# EAGLE design mainboardv3.4 (EAGLE 6.4)
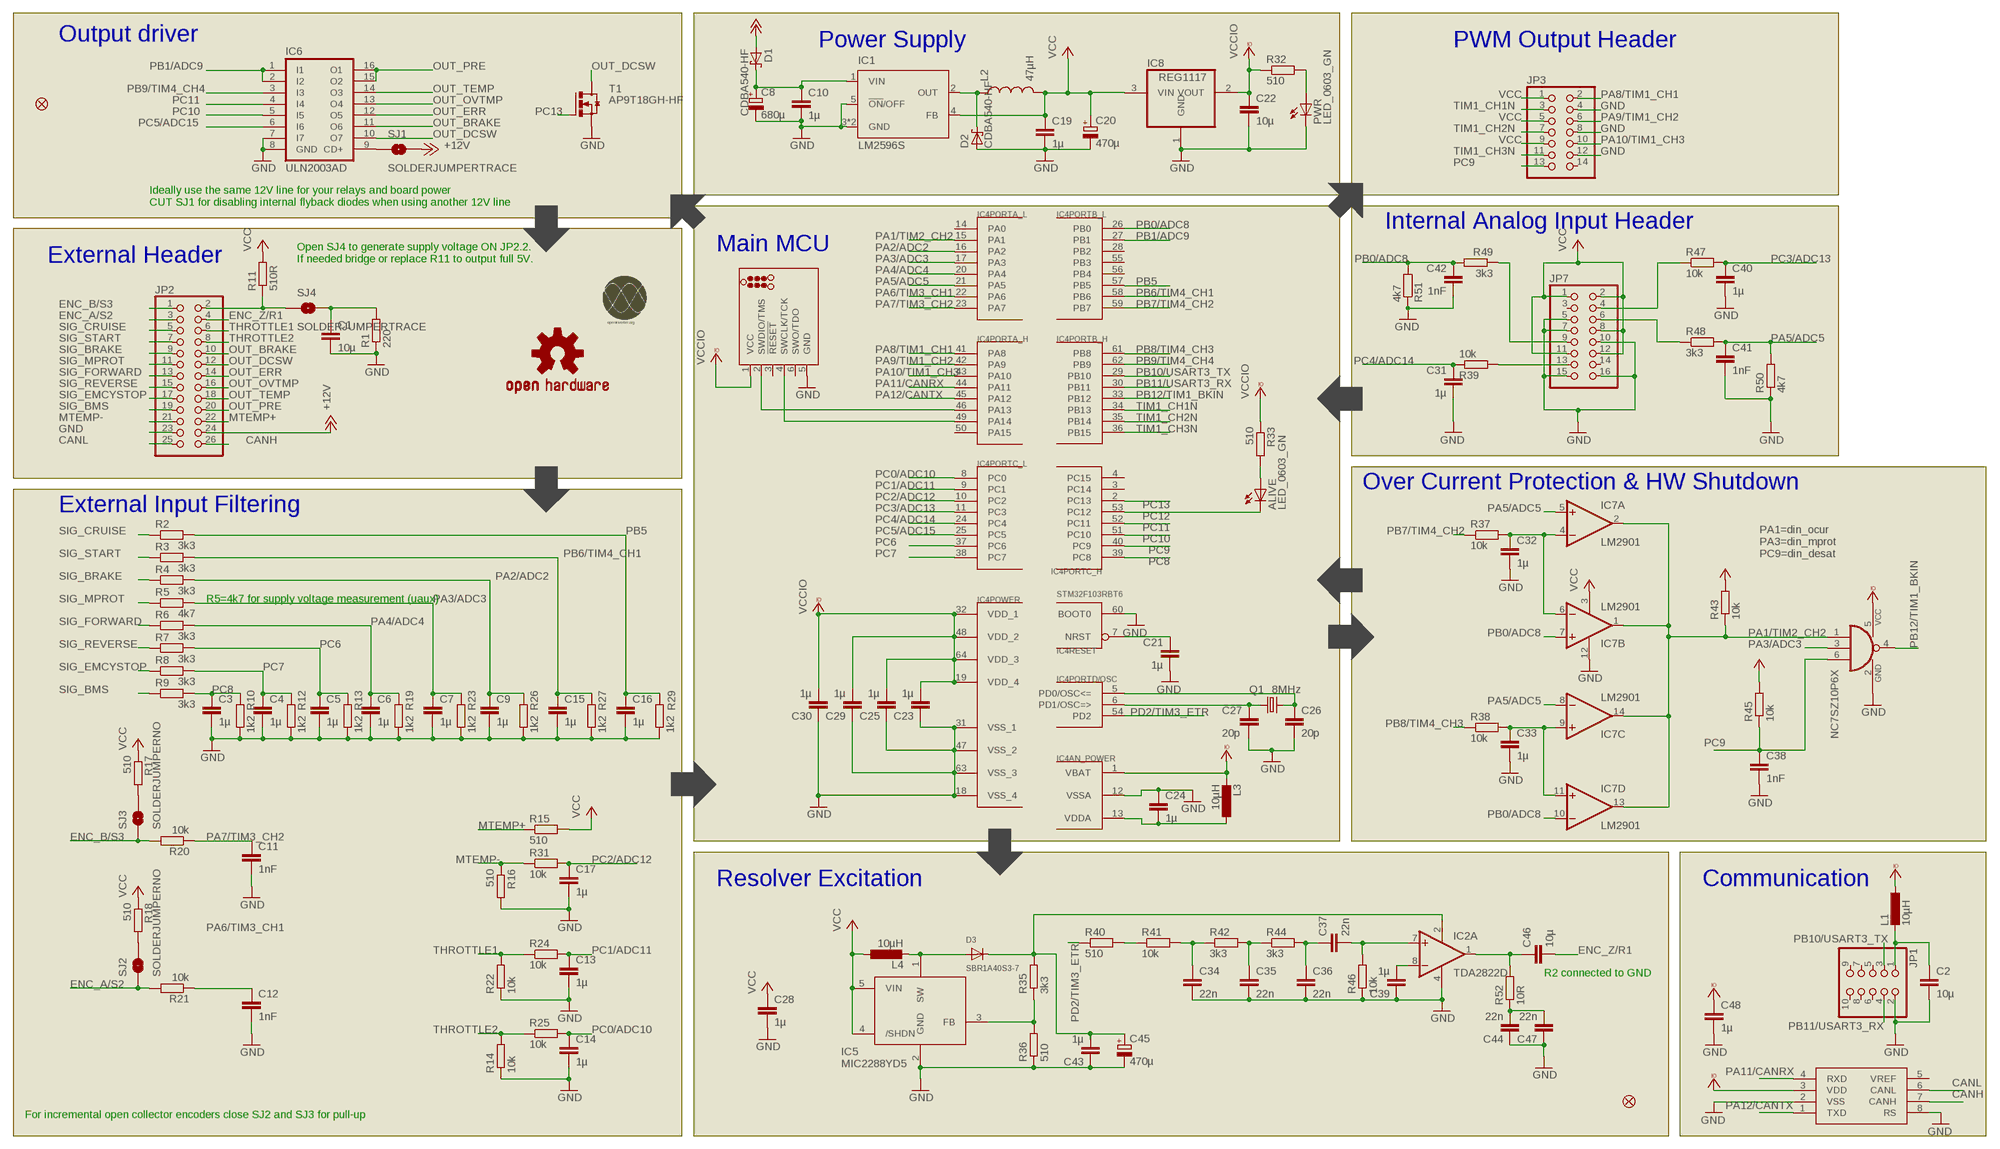
[diagram p0: schematic, sheet 1]

## Parts
ALIVE  LED_0603_GN  LEDSML0805  [SML0805]
C1  10µ  C-EUC0805  [C0805]
C2  10µ  C-EUC0805  [C0805]
C3  1µ  C-EUC0603  [C0603]
C4  1µ  C-EUC0603  [C0603]
C5  1µ  C-EUC0603  [C0603]
C6  1µ  C-EUC0603  [C0603]
C7  1µ  C-EUC0603  [C0603]
C8  680µ  CPOL-EUUD-10X10  [UD-10X10_NICHICON]
C9  1µ  C-EUC0603  [C0603]
C10  1µ  C-EUC0603  [C0603]
C11  1nF  C-EUC0603  [C0603]
C12  1nF  C-EUC0603  [C0603]
C13  1µ  C-EUC0603  [C0603]
C14  1µ  C-EUC0603  [C0603]
C15  1µ  C-EUC0603  [C0603]
C16  1µ  C-EUC0603  [C0603]
C17  1µ  C-EUC0603  [C0603]
C19  1µ  C-EUC0603  [C0603]
C20  470µ  CPOL-EUUD-6,3X7,7  [UD-6,3X7,7_NICHICON]
C21  1µ  C-EUC0603  [C0603]
C22  10µ  C-EUC0805  [C0805]
C23  1µ  C-EUC0603  [C0603]
C24  1µ  C-EUC0603  [C0603]
C25  1µ  C-EUC0603  [C0603]
C26  20p  C-EUC0603  [C0603]
C27  20p  C-EUC0603  [C0603]
C28  1µ  C-EUC0603  [C0603]
C29  1µ  C-EUC0603  [C0603]
C30  1µ  C-EUC0603  [C0603]
C31  1µ  C-EUC0603  [C0603]
C32  1µ  C-EUC0603  [C0603]
C33  1µ  C-EUC0603  [C0603]
C34  22n  C-EUC0603  [C0603]
C35  22n  C-EUC0603  [C0603]
C36  22n  C-EUC0603  [C0603]
C37  22n  C-EUC0603  [C0603]
C38  1nF  C-EUC0603  [C0603]
C39  1µ  C-EUC0603  [C0603]
C40  1µ  C-EUC0603  [C0603]
C41  1nF  C-EUC0603  [C0603]
C42  1nF  C-EUC0603  [C0603]
C43  1µ  C-EUC0603  [C0603]
C44  22n  C-EUC0603  [C0603]
C45  470µ  CPOL-EUUD-6,3X7,7  [UD-6,3X7,7_NICHICON]
C46  10µ  C-EUC0805  [C0805]
C47  22n  C-EUC0603  [C0603]
C48  1µ  C-EUC0603  [C0603]
D1  CDBA540-HF  SCHOTTKY-DIODESMD  [SMB]
D2  CDBA540-HF  SCHOTTKY-DIODESMD  [SMB]
D3  SBR1A40S3-7  DIODESOD-323F  [SOD-323F]
FID1  FIDUCIAL1X2.5  [FIDUCIAL-1X2.5]
FID2  FIDUCIAL1X2.5  [FIDUCIAL-1X2.5]
IC1  LM2596S  [TO263-5]
IC2  TDA2822D  [SO08]
IC3  SN65HVD230DR  MCP2551  [SO08]
IC4  STM32F103RBT6  STM32F10XRXT6  [TQFP64]
IC5  MIC2288YD5  [SOT23-5L]
IC6  ULN2003AD  [SO16]
IC7  LM2901  LM339D  [SO14]
IC8  REG1117  [SOT223]
IC9  NC7SZ10P6X  741G10X  [SC70-6]
J1  TC2030_SWD-MCP  [TC2030-MCP]
JP1  PINHD-2X5/90  [2X05/90]
JP2  PINHD-2X13  [2X13]
JP3  PINHD-2X7  [2X07]
JP7  PINHD-2X8  [2X08]
L1  10µH  L-EUL2012C  [L2012C]
L2  47µH  INDUCTORPWR  [CDRH125]
L3  10µH  L-EUL2012C  [L2012C]
L4  10µH  L-EUL2825P  [L2825P]
LOGO1  OSHW-LOGOM  [OSHW-LOGO-M]
PWR  LED_0603_GN  LEDSML0805  [SML0805]
Q1  8MHz  CRYSTALTXC-7A  [CRYSTAL-TXC-7A]
R1  220  R-EU_R0603  [R0603]
R2  3k3  R-EU_R0603  [R0603]
R3  3k3  R-EU_R0603  [R0603]
R4  3k3  R-EU_R0603  [R0603]
R5  4k7  R-EU_R0603  [R0603]
R6  3k3  R-EU_R0603  [R0603]
R7  3k3  R-EU_R0603  [R0603]
R8  3k3  R-EU_R0603  [R0603]
R9  3k3  R-EU_R0603  [R0603]
R10  1k2  R-EU_R0603  [R0603]
R11  510R  R-EU_R0603  [R0603]
R12  1k2  R-EU_R0603  [R0603]
R13  1k2  R-EU_R0603  [R0603]
R14  10k  R-EU_R0603  [R0603]
R15  510  R-EU_R0603  [R0603]
R16  510  R-EU_R0603  [R0603]
R17  510  R-EU_R0603  [R0603]
R18  510  R-EU_R0603  [R0603]
R19  1k2  R-EU_R0603  [R0603]
R20  10k  R-EU_R0603  [R0603]
R21  10k  R-EU_R0603  [R0603]
R22  10k  R-EU_R0603  [R0603]
R23  1k2  R-EU_R0603  [R0603]
R24  10k  R-EU_R0603  [R0603]
R25  10k  R-EU_R0603  [R0603]
R26  1k2  R-EU_R0603  [R0603]
R27  1k2  R-EU_R0603  [R0603]
R29  1k2  R-EU_R0603  [R0603]
R31  10k  R-EU_R0603  [R0603]
R32  510  R-EU_R0603  [R0603]
R33  510  R-EU_R0603  [R0603]
R35  3k3  R-EU_R0603  [R0603]
R36  510  R-EU_R0603  [R0603]
R37  10k  R-EU_R0603  [R0603]
R38  10k  R-EU_R0603  [R0603]
R39  10k  R-EU_R0603  [R0603]
R40  510  R-EU_R0603  [R0603]
R41  10k  R-EU_R0603  [R0603]
R42  3k3  R-EU_R0603  [R0603]
R43  10k  R-EU_R0603  [R0603]
R44  3k3  R-EU_R0603  [R0603]
R45  10k  R-EU_R0603  [R0603]
R46  10k  R-EU_R0603  [R0603]
R47  10k  R-EU_R0603  [R0603]
R48  3k3  R-EU_R0603  [R0603]
R49  3k3  R-EU_R0603  [R0603]
R50  4k7  R-EU_R0603  [R0603]
R51  4k7  R-EU_R0603  [R0603]
R52  10R  R-EU_R0603  [R0603]
SJ1  SOLDERJUMPERTRACE  [SJ_2S-TRACE]
SJ2  SOLDERJUMPERNO  [SJ_2S-NO]
SJ3  SOLDERJUMPERNO  [SJ_2S-NO]
SJ4  SOLDERJUMPERTRACE  [SJ_2S-TRACE]
T1  AP9T18GH-HF  [D-PAK_TO252AA]
U$1  OI-LOGO  [OI_LOGO]

## Nets
+12V: D1.A JP2.24 SJ1.2
CANH: IC3.7(CANH) JP2.26
CANL: IC3.6(CANL) JP2.25
ENC_A/S2: JP2.3 R21.2 SJ2.1
ENC_B/S3: JP2.1 R20.2 SJ3.1
ENC_Z/R1: C46.2 JP2.4
GND: C1.2 C2.2 C3.2 C4.2 C5.2 C6.2 C7.2 C8.- C9.2 C10.2 C11.2 C12.2 C13.2 C14.2 C15.2 C16.2 C17.2 C19.2 C20.- C21.2 C22.2 C23.1 C24.1 C25.1 C26.2 C27.2 C28.2 C29.1 C30.1 C31.2 C32.2 C33.2 C34.2 C35.2 C36.2 C38.2 C39.1 C40.2 C41.2 C42.2 C43.1 C44.1 C45.- C47.1 C48.2 D2.A IC1.3(GND) IC1.5(!ON!/OFF) IC1.6(GND) IC2.4(P:V-) IC3.2(VSS) IC3.8(RS) IC4.12(AN_POWER:VSSA) IC4.18(POWER:VSS_4) IC4.31(POWER:VSS_1) IC4.47(POWER:VSS_2) IC4.60(RESET:BOOT0) IC4.63(POWER:VSS_3) IC5.2(GND) IC6.7(I7) IC6.8(GND) IC7.12(P:GND) IC8.1(GND) IC9.2(PWR:GND) J1.5(GND) JP1.2 JP2.23 JP3.4 JP3.8 JP3.12 JP7.5 JP7.7 JP7.10 JP7.15 JP7.16 PWR.C R1.1 R10.1 R12.1 R13.1 R14.1 R16.2 R19.1 R22.1 R23.1 R26.1 R27.1 R29.1 R36.1 R46.1 R50.1 R51.1 T1.3(S)
I_L1: JP7.6 R48.1
I_L2: JP7.9 R49.1
MTEMP+: JP2.22 R15.1
MTEMP-: JP2.21 R16.1 R31.1
N$1: IC6.9(CD+) SJ1.1
N$2: C27.1 IC4.6(PORTD/OSC:PD1/OSC=>) Q1.P$1
N$3: R17.2 SJ3.2
N$4: C26.1 IC4.5(PORTD/OSC:PD0/OSC<=) Q1.P$2
N$5: IC4.46(PORTA_H:PA13) J1.2(SWDIO/TMS)
N$6: IC4.49(PORTA_H:PA14) J1.4(SWCLK/TCK)
N$7: C24.2 IC4.13(AN_POWER:VDDA) L3.1
N$8: R18.2 SJ2.2
N$9: C1.1 R1.2 SJ4.2
N$10: C33.1 IC7.9(C:+IN) IC7.11(D:+IN) R38.2
N$11: C44.2 C47.2 R52.1
N$12: R40.2 R41.1
N$14: D2.C IC1.2(OUT) L2.1
N$15: C32.1 IC7.4(A:-IN) IC7.6(B:-IN) R37.2
N$17: C35.1 R42.2 R44.1
N$18: C36.1 C37.1 R44.2
N$19: C37.2 IC2.7(A:+IN) R46.2
N$20: C46.1 IC2.1(A:OUT) R52.2
N$21: C43.2 C45.+ D3.C IC2.2(P:V+) R35.2
N$22: PWR.A R32.2
N$23: ALIVE.A R33.2
N$24: IC5.3(FB) R35.1 R36.2
N$25: C8.+ C10.1 D1.C IC1.1(VIN)
N$26: D3.A IC5.1(SW) L4.2
N$27: C39.2 IC2.8(A:-IN)
N$28: C2.1 JP1.1 L1.2
N$30: C34.1 R41.2 R42.1
NRST: C21.1 IC4.7(RESET:NRST)
OUT_BRAKE: IC6.11(O6) JP2.10
OUT_DCSW: IC6.10(O7) JP2.12 T1.4(D)
OUT_ERR: IC6.12(O5) JP2.14
OUT_OVTMP: IC6.13(O4) JP2.16
OUT_PRE: IC6.15(O2) IC6.16(O1) JP2.20
OUT_TEMP: IC6.14(O3) JP2.18
PA1/TIM2_CH2: IC4.15(PORTA_L:PA1) IC7.1(B:OUT) IC7.2(A:OUT) IC7.13(D:OUT) IC7.14(C:OUT) IC9.1(>NAME:I0) R43.1
PA2/ADC2: C9.1 IC4.16(PORTA_L:PA2) R4.2 R26.2
PA3/ADC3: C7.1 IC4.17(PORTA_L:PA3) IC9.3(>NAME:I1) R5.2 R23.2
PA4/ADC4: C6.1 IC4.20(PORTA_L:PA4) R6.2 R19.2
PA5/ADC5: C41.1 IC4.21(PORTA_L:PA5) IC7.5(A:+IN) IC7.8(C:-IN) R48.2 R50.2
PA6/TIM3_CH1: C12.1 IC4.22(PORTA_L:PA6) R21.1
PA7/TIM3_CH2: C11.1 IC4.23(PORTA_L:PA7) R20.1
PA8/TIM1_CH1: IC4.41(PORTA_H:PA8) JP3.2
PA9/TIM1_CH2: IC4.42(PORTA_H:PA9) JP3.6
PA10/TIM1_CH3: IC4.43(PORTA_H:PA10) JP3.10
PA11/CANRX: IC3.4(RXD) IC4.44(PORTA_H:PA11)
PA12/CANTX: IC3.1(TXD) IC4.45(PORTA_H:PA12)
PB0/ADC8: C42.1 IC4.26(PORTB_L:PB0) IC7.7(B:+IN) IC7.10(D:-IN) R49.2 R51.2
PB1/ADC9: IC4.27(PORTB_L:PB1) IC6.1(I1) IC6.2(I2)
PB5: C16.1 IC4.57(PORTB_L:PB5) R2.2 R29.2
PB6/TIM4_CH1: C15.1 IC4.58(PORTB_L:PB6) R3.2 R27.2
PB7/TIM4_CH2: IC4.59(PORTB_L:PB7) R37.1
PB8/TIM4_CH3: IC4.61(PORTB_H:PB8) R38.1
PB9/TIM4_CH4: IC4.62(PORTB_H:PB9) IC6.3(I3)
PB10/USART3_TX: IC4.29(PORTB_H:PB10) JP1.3
PB11/USART3_RX: IC4.30(PORTB_H:PB11) JP1.4
PB12/TIM1_BKIN: IC4.33(PORTB_H:PB12) IC9.4(>NAME:O)
PC0/ADC10: C14.1 IC4.8(PORTC_L:PC0) R25.2
PC1/ADC11: C13.1 IC4.9(PORTC_L:PC1) R24.2
PC2/ADC12: C17.1 IC4.10(PORTC_L:PC2) R31.2
PC3/ADC13: C40.1 IC4.11(PORTC_L:PC3) R47.2
PC4/ADC14: C31.1 IC4.24(PORTC_L:PC4) R39.1
PC5/ADC15: IC4.25(PORTC_L:PC5) IC6.6(I6)
PC6: C5.1 IC4.37(PORTC_L:PC6) R7.2 R13.2
PC7: C4.1 IC4.38(PORTC_L:PC7) R8.2 R12.2
PC8: C3.1 IC4.39(PORTC_H:PC8) R9.2 R10.2
PC9: C38.1 IC4.40(PORTC_H:PC9) IC9.6(>NAME:I2) JP3.13 R45.1
PC10: IC4.51(PORTC_H:PC10) IC6.5(I5)
PC11: IC4.52(PORTC_H:PC11) IC6.4(I4)
PC12: ALIVE.C IC4.53(PORTC_H:PC12)
PC13: IC4.2(PORTC_H:PC13) T1.1(G)
PD2/TIM3_ETR: IC4.54(PORTD/OSC:PD2) R40.1
S4/S1: JP2.2 R11.1 SJ4.1
SIG_BMS: JP2.19 R9.1
SIG_BRAKE: JP2.9 R4.1
SIG_CRUISE: JP2.5 R2.1
SIG_EMCYSTOP: JP2.17 R8.1
SIG_FORWARD: JP2.13 R6.1
SIG_MPROT: JP2.11 R5.1
SIG_REVERSE: JP2.15 R7.1
SIG_START: JP2.7 R3.1
THROTTLE1: JP2.6 R22.2 R24.1
THROTTLE2: JP2.8 R14.2 R25.1
TIM1_CH1N: IC4.34(PORTB_H:PB13) JP3.3
TIM1_CH2N: IC4.35(PORTB_H:PB14) JP3.7
TIM1_CH3N: IC4.36(PORTB_H:PB15) JP3.11
TMPHS: JP7.13 R39.2
UDC: JP7.4 R47.1
VCC: C19.1 C20.+ C28.1 IC1.4(FB) IC5.4(/SHDN) IC5.5(VIN) IC7.3(P:V+) IC8.3(VIN) JP3.1 JP3.5 JP3.9 JP7.1 JP7.2 JP7.8 JP7.11 JP7.12 L2.2 L4.1 R11.2 R15.2 R17.1 R18.1 R43.2 R45.2
VCCIO: C22.1 C23.2 C25.2 C29.2 C30.2 C48.1 IC3.3(VDD) IC4.1(AN_POWER:VBAT) IC4.19(POWER:VDD_4) IC4.32(POWER:VDD_1) IC4.48(POWER:VDD_2) IC4.64(POWER:VDD_3) IC8.2(VOUT) IC9.5(PWR:VCC) J1.1(VCC) L1.1 L3.2 R32.1 R33.1
Unconnected: IC2.3(B:OUT) IC2.5(B:-IN) IC2.6(B:+IN) IC3.5(VREF) IC4.3(PORTC_H:PC14) IC4.4(PORTC_H:PC15) IC4.14(PORTA_L:PA0) IC4.28(PORTB_L:PB2) IC4.50(PORTA_H:PA15) IC4.55(PORTB_L:PB3) IC4.56(PORTB_L:PB4) J1.3(!RESET) J1.6(SWO/TDO) JP1.5 JP1.6 JP1.7 JP1.8 JP1.9 JP1.10 JP3.14 JP7.3 JP7.14

## Notes on the sheet
- Output driver | Power Supply | PWM Output Header
- Ideally use the same 12V line for your relays and board power
  CUT SJ1 for disabling internal flyback diodes when using another 12V line
- Internal Analog Input Header
- Main MCU
- External Header
- Open SJ4 to generate supply voltage ON JP2.2. 
  If needed bridge or replace R11 to output full 5V.
- Over Current Protection & HW Shutdown
- External Input Filtering
- PA1=din_ocur
  PA3=din_mprot
  PC9=din_desat
- R5=4k7 for supply voltage measurement (uaux)
- Resolver Excitation | Communication
- R2 connected to GND
- IC5
  MIC2288YD5
- For incremental open collector encoders close SJ2 and SJ3 for pull-up

## Library data of the parts
ALIVE PWR = led:LED: LED OSRAM: - CHIPLED LG R971, LG N971, LY N971, LG Q971, LY Q971, LO R971, LY R971 LH N974, LH R974 LS Q976, LO Q976, LY Q976 LO Q996 - Hyper CHIPLED LW Q18S LB Q993, LB Q99A, LB R99A - SideLED LS A670, LO A670, LY A670, LG A670, LP A670 LB A673, LV A673, LT A673, LW A673 LH A674 LY A675 LS A676, LA A676, LO A676, LY A676, LW A676 LS A679, LY A679, LG A679 - Hyper Micro SIDELED® LS Y876, LA Y876, LO Y876, LY Y876 LT Y87S - SmartLED LW L88C, LW L88S LB L89C, LB L89S, LG L890 LS L89K, LO L89K, LY L89K LS L896, LA L896, LO L896, LY L896 - TOPLED LS T670, LO T670, LY T670, LG T670, LP T670 LSG T670, LSP T670, LSY T670, LOP T670, LYG T670 LG T671, LOG T671, LSG T671 LB T673, LV T673, LT T673, LW T673 LH T674 LS T676, LA T676, LO T676, LY T676, LB T676, LH T676, LSB T676, LW T676 LB T67C, LV T67C, LT T67C, LS T67K, LO T67K, LY T67K, LW E67C LS E67B, LA E67B, LO E67B, LY E67B, LB E67C, LV E67C, LT E67C LW T67C LS T679, LY T679, LG T679 LS T770, LO T770, LY T770, LG T770, LP T770 LB T773, LV T773, LT T773, LW T773 LH T774 LS E675, LA E675, LY E675, LS T675 LS T776, LA T776, LO T776, LY T776, LB T776 LHGB T686 LT T68C, LB T68C - Hyper Mini TOPLED® LB M676 - Mini TOPLED Santana® LG M470 LS M47K, LO M47K, LY M47K Source: http://www.osram.convergy.de LUXEON: - LUMILED® LXK2-PW12-R00, LXK2-PW12-S00, LXK2-PW14-U00, LXK2-PW14-V00 LXK2-PM12-R00, LXK2-PM12-S00, LXK2-PM14-U00 LXK2-PE12-Q00, LXK2-PE12-R00, LXK2-PE12-S00, LXK2-PE14-T00, LXK2-PE14-U00 LXK2-PB12-K00, LXK2-PB12-L00, LXK2-PB12-M00, LXK2-PB14-N00, LXK2-PB14-P00, LXK2-PB14-Q00 LXK2-PR12-L00, LXK2-PR12-M00, LXK2-PR14-Q00, LXK2-PR14-R00 LXK2-PD12-Q00, LXK2-PD12-R00, LXK2-PD12-S00 LXK2-PH12-R00, LXK2-PH12-S00 LXK2-PL12-P00, LXK2-PL12-Q00, LXK2-PL12-R00 Source: www.luxeon.com KINGBRIGHT: KA-3528ASYC Source: www.kingbright.com
C1-C7 C9-C17 C19 C21-C44 C46-C48 = rcl:C-EU: CAPACITOR, European symbol
C8 C20 C45 = rcl:CPOL-EU: POLARIZED CAPACITOR, European symbol
D1 D2 = diode:SCHOTTKY-DIODE: Schottky Diode
D3 = adafruit:DIODE: Diode SMADIODE - SMA Surface Mount Package 20V 1A Schottky Diode Digikey: 641-1014-6-ND DO-1N4148 - Through Hole Small Current Diode SOD-123 20V 1 A (.5mV Vf) Schottky Diode - Digikey: MBRX120TPMSCT-ND SOD-323 10V 570mA (.38mV Vf, 3ns) Schottky Diode - Digikey: ZLLS410CT-ND SOD-523 30V 30mA Schottky Diode (RB751S-40TE61) - Digikey: RB751S-40TE61CT-ND SOT23-R/W - SOT23 Package (R = Solder Paste/Reflow Ovens, W = Hand-Soldering) BAT54Film 40V 300mA - Digikey: 497-7162-1-ND
FID1 FID2 = SparkFun-Aesthetics:FIDUCIAL: Fiducial Alignment Points Various fiducial points for machine vision alignment.
IC1 = national-semiconductor:LM2596: SIMPLE SWITCHER® Power Converter 150 kHz 3A Step-Down Voltage Regulator Source: http://www.national.com/ds/LM/LM2596.pdf; MF: NATIONAL SEMICONDUCTOR; MPN: LM2596S-ADJ/NOPB; OC_FARNELL: 9494367; OC_NEWARK: 41K3842
IC2 = st-microelectronics:TDA2822: OP AMP
IC3 = SparkFun-DigitalIC:MCP2551: CAN transceiver
IC4 = stm32:STM32F10XRXT6: STM32F101/103 64pin LQFP
IC5 = adafruit:MIC2288
IC6 = uln-udn:ULN2003A: DRIVER ARRAY
IC7 = linear:LM339: Low Power Low Offset Voltage Quad Comparators with open collector; LM139/LM239/LM339/LM2901/LM3302
IC8 = burr-brown:REG1117: 800mA and 1A Low Dropout (LDO) Positive Regulator 1.8V, 2.5V, 2.85V, 3.3V, 5V, and Adj; MPN: REG1117; OC_FARNELL: 1097566; OC_NEWARK: 14P6981
IC9 = 74xx-eu:74*1G10: 3-input NAND gate
J1 = tag-connect:TC2030_SWD: ARM20-CTX 20-Pin to TC2030-IDC Adapter for Cortex 6-Pin (TC2030-IDC family) </catalog/6> Cortex SWD </catalog/9> Adapters </adaptors> <javascript:void(0);> The Tag-Connect ARM20-CTX adapter board allows our TC2030-IDC cables to be used for ARM SWD (Single Wire Debug) applications. Although intended for use with our patented TC2030-IDC (and TC2030-IDC-NL) Plug-of-Nails™ Cables, the adapter may be useful to people wishing to use 6-pin 0.1” ribbon headers on their PCB instead of the traditional 20-Pin header. Please note the TC2030-IDC <http://tag-connect.com/TC2030-IDC> or TC2030-IDC-NL <http://tag-connect.com/TC2030-IDC-NL> cable is purchased separately, the cables and Segger JLINK seen in the pictures are not included! Download the Datasheet here. <http://www.tag-connect.com/Materials/ARM20-CTX.pdf>
JP1 = pinhead:PINHD-2X5: PIN HEADER
JP2 = pinhead:PINHD-2X13: PIN HEADER
JP3 = pinhead:PINHD-2X7: PIN HEADER
JP7 = pinhead:PINHD-2X8: PIN HEADER
L1 L3 L4 = rcl:L-EU: INDUCTOR, European symbol
L2 = SparkFun-Passives:INDUCTOR: Inductors Basic Inductor/Choke - 0603 and 1206. Footprints are not proven and vary greatly between part numbers. SRN6045- 33uH, 20% 1.4A
LOGO1 = SparkFun-Aesthetics:OSHW-LOGO: Open Source Hardware Logo This logo indicates the piece of hardware it is found on incorporates a OSHW license and/or adheres to the definition of open source hardware found here: http://freedomdefined.org/OSHW
Q1 = SparkFun-FreqCtrl:CRYSTAL: Various standard crystals. Proven footprints. Spark Fun Electronics SKU : COM-00534
R1-R27 R29 R31-R33 R35-R52 = rcl:R-EU_: RESISTOR, European symbol
SJ1-SJ4 = SparkFun-Passives:SOLDERJUMPER: Solder Jumper Standard SMD solder jumper. Used to automate production. Two varients : Normally Open and Normally Closed are the same, but have different paste layers. NC will have a large amount of paste and should jumper during reflow.
T1 = transistor-power:AP9T18GH-HF
U$1 = SparkFun-Aesthetics:OI-LOGO

## Board
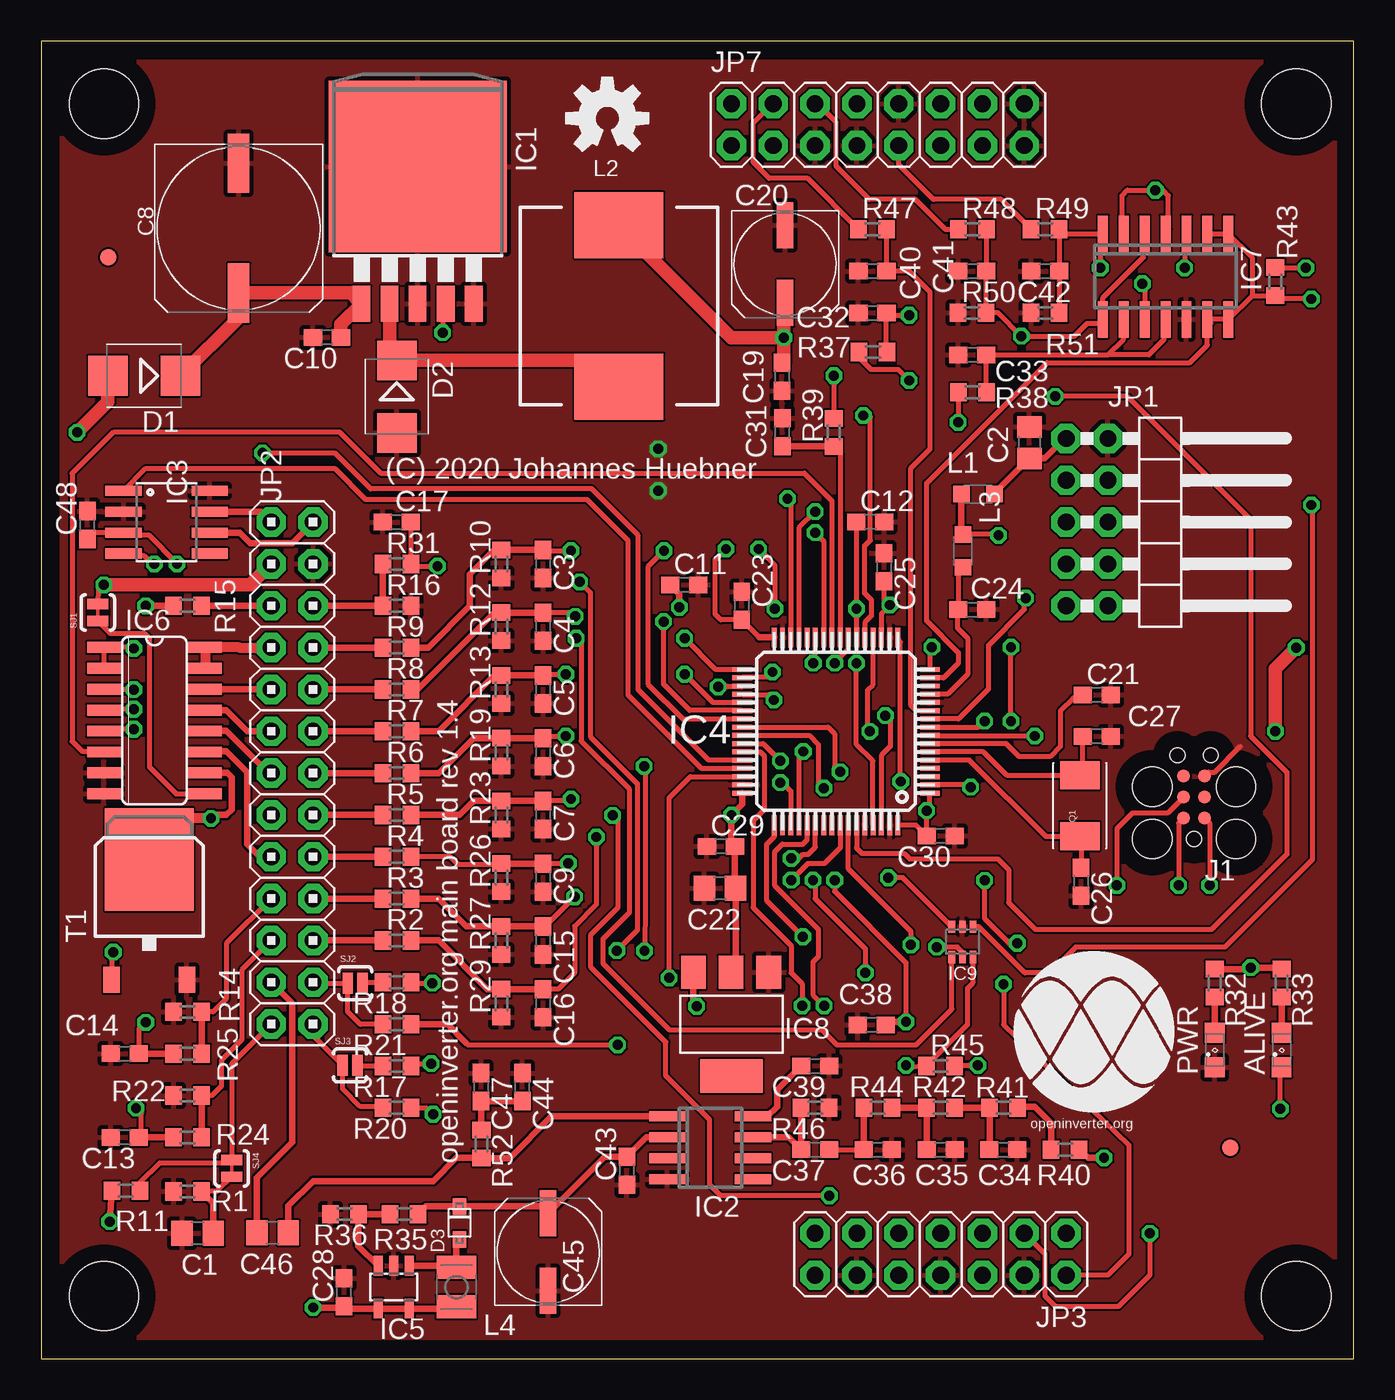
[diagram p1: board, top side]
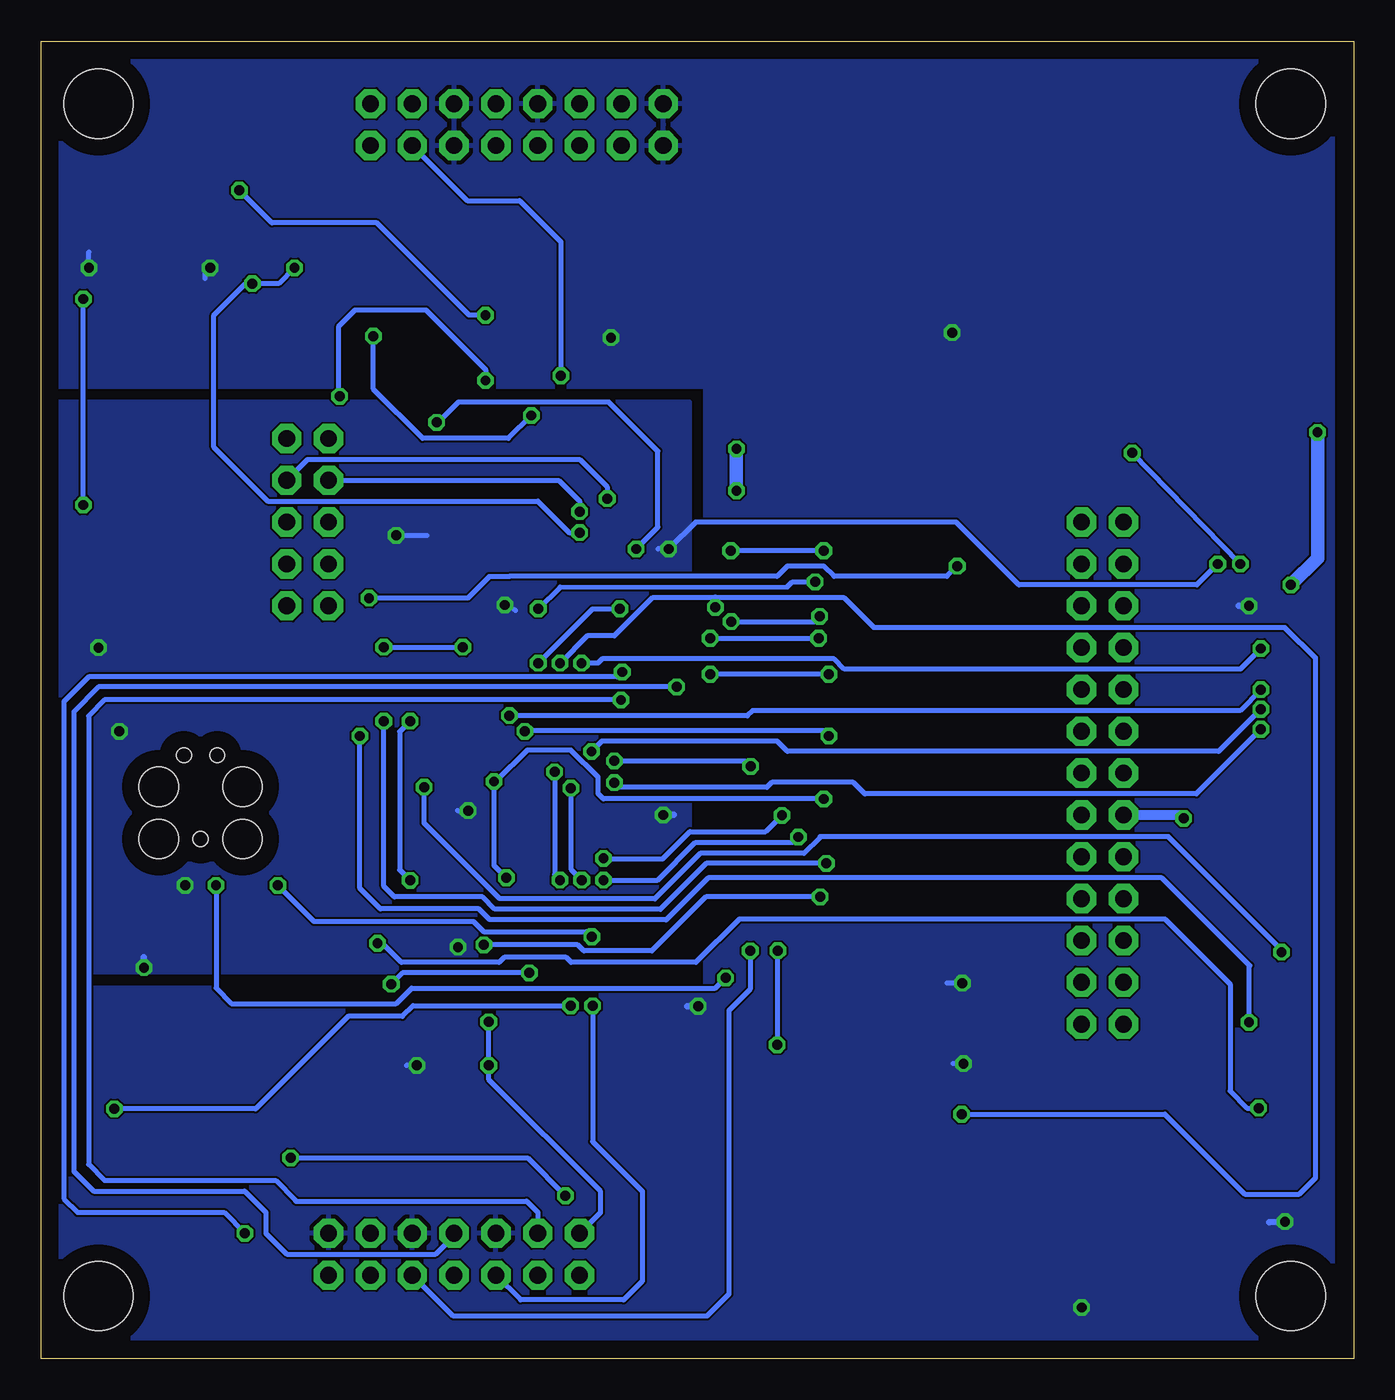
[diagram p2: board, bottom side, seen from below]

Size 79.68 x 80 mm. Coordinates in mm from the lower left corner, seen from the top.
Outline: 0,0 79.68,0 79.68,80 0,80 0,0
Copper layers (1*16): Top 0.035mm / dielectric 1.5mm / Bottom 0.035mm
Design rules "default *": minimum track width 10mil, minimum drill 0.5mm, track to track 5mil, track to pad 5mil, pad to pad 5mil, via to via 5mil, smd to smd 5mil, copper to edge 40mil, drill to drill 8mil, minimum pad ring 15mil, minimum via ring 8mil, stop-mask expansion 4mil, vias tented up to drill 0mil, thermal gap 10mil
Holes 4.2 mm at 3.81,76.2 76.2,76.2 3.81,3.81 76.2,3.81

### Footprints (pad centres in the part's own frame; a part is rotated, then mirrored left to right if it is on the bottom)
SML0805 = smd 1.2 x 1.2: A 1.05,0; C -1.05,0
C0805 = smd 1.3 x 1.5: 1 -0.95,0; 2 0.95,0
C0603 = smd 1.1 x 1: 1 -0.85,0; 2 0.85,0
UD-10X10_NICHICON = smd 3.6 x 1.3: + 3.925,0; - -3.95,0
UD-6,3X7,7_NICHICON = smd 2.8 x 1: + 2.35,0; - -2.35,0
SMB = smd 2.4 x 2.4: A 2.2,0; C -2.2,0
SOD-323F = smd 1 x 0.8: A -1,0; C 1,0
FIDUCIAL-1X2.5 = smd 1 x 1: 1 0,0
TO263-5 = smd 1.067 x 2.159: 1 -3.404,-5.791; 2 -1.702,-5.791; 3 0,-5.791; 4 1.702,-5.791; 5 3.404,-5.791 | smd 10.8 x 10.41: 6 0,2.54
SO08 = smd 0.6 x 2.2: 1 -1.905,-2.6; 2 -0.635,-2.6; 3 0.635,-2.6; 4 1.905,-2.6; 5 1.905,2.6; 6 0.635,2.6; 7 -0.635,2.6; 8 -1.905,2.6
SO08' = smd 0.61 x 2.21: 1 -1.905,-2.616; 2 -0.635,-2.616; 3 0.635,-2.616; 4 1.905,-2.616; 5 1.905,2.616; 6 0.635,2.616; 7 -0.635,2.616; 8 -1.905,2.616
TQFP64 = smd 1.2 x 0.3: 1 -5.7,3.75; 2 -5.7,3.25; 3 -5.7,2.75; 4 -5.7,2.25; 5 -5.7,1.75; 6 -5.7,1.25; 7 -5.7,0.75; 8 -5.7,0.25; 9 -5.7,-0.25; 10 -5.7,-0.75; 11 -5.7,-1.25; 12 -5.7,-1.75; 13 -5.7,-2.25; 14 -5.7,-2.75; 15 -5.7,-3.25; 16 -5.7,-3.75; 33 5.7,-3.75; 34 5.7,-3.25; 35 5.7,-2.75; 36 5.7,-2.25; 37 5.7,-1.75; 38 5.7,-1.25; 39 5.7,-0.75; 40 5.7,-0.25; 41 5.7,0.25; 42 5.7,0.75; 43 5.7,1.25; 44 5.7,1.75; 45 5.7,2.25; 46 5.7,2.75; 47 5.7,3.25; 48 5.7,3.75 | smd 0.3 x 1.2: 17 -3.75,-5.7; 18 -3.25,-5.7; 19 -2.75,-5.7; 20 -2.25,-5.7; 21 -1.75,-5.7; 22 -1.25,-5.7; 23 -0.75,-5.7; 24 -0.25,-5.7; 25 0.25,-5.7; 26 0.75,-5.7; 27 1.25,-5.7; 28 1.75,-5.7; 29 2.25,-5.7; 30 2.75,-5.7; 31 3.25,-5.7; 32 3.75,-5.7; 49 3.75,5.7; 50 3.25,5.7; 51 2.75,5.7; 52 2.25,5.7; 53 1.75,5.7; 54 1.25,5.7; 55 0.75,5.7; 56 0.25,5.7; 57 -0.25,5.7; 58 -0.75,5.7; 59 -1.25,5.7; 60 -1.75,5.7; 61 -2.25,5.7; 62 -2.75,5.7; 63 -3.25,5.7; 64 -3.75,5.7
SOT23-5L = smd 0.55 x 1.2: 1 -0.95,-1.3; 2 0,-1.3; 3 0.95,-1.3; 4 0.95,1.3; 5 -0.95,1.3
SO16 = smd 0.66 x 2.032: 1 -4.445,-3.073; 2 -3.175,-3.073; 3 -1.905,-3.073; 4 -0.635,-3.073; 5 0.635,-3.073; 6 1.905,-3.073; 7 3.175,-3.073; 8 4.445,-3.073; 9 4.445,3.073; 10 3.175,3.073; 11 1.905,3.073; 12 0.635,3.073; 13 -0.635,3.073; 14 -1.905,3.073; 15 -3.175,3.073; 16 -4.445,3.073
SO14 = smd 0.6 x 2.2: 1 -3.81,-2.6; 2 -2.54,-2.6; 3 -1.27,-2.6; 4 0,-2.6; 5 1.27,-2.6; 6 2.54,-2.6; 7 3.81,-2.6; 8 3.81,2.6; 9 2.54,2.6; 10 1.27,2.6; 11 0,2.6; 12 -1.27,2.6; 13 -2.54,2.6; 14 -3.81,2.6
SOT223 = smd 1.499 x 2.007: 1 -2.261,-3.15; 2 0.025,-3.15; 3 2.311,-3.15 | smd 3.81 x 2.007: 4 0,3.15
SC70-6 = smd 0.4 x 0.75: 1 -0.65,-0.925; 2 0,-0.925; 3 0.65,-0.925; 4 0.65,0.925; 5 0,0.925; 6 -0.65,0.925
TC2030-MCP = smd 0.787 x 0.787: 1 1.27,-0.635; 2 1.27,0.635; 3 2.54,-0.635; 4 2.54,0.635; 5 3.81,-0.635; 6 3.81,0.635 | hole 0.889: 0,0; 5.08,-1.016; 5.08,1.016 | hole 2.375: 0,2.54; 0,-2.54; 3.175,-2.54; 3.175,2.54
2X05/90 = drill 1.016 octagon: 1 -5.08,-6.35; 2 -5.08,-3.81; 3 -2.54,-6.35; 4 -2.54,-3.81; 5 0,-6.35; 6 0,-3.81; 7 2.54,-6.35; 8 2.54,-3.81; 9 5.08,-6.35; 10 5.08,-3.81
2X13 = drill 1.016 octagon: 1 -15.24,-1.27; 2 -15.24,1.27; 3 -12.7,-1.27; 4 -12.7,1.27; 5 -10.16,-1.27; 6 -10.16,1.27; 7 -7.62,-1.27; 8 -7.62,1.27; 9 -5.08,-1.27; 10 -5.08,1.27; 11 -2.54,-1.27; 12 -2.54,1.27; 13 0,-1.27; 14 0,1.27; 15 2.54,-1.27; 16 2.54,1.27; 17 5.08,-1.27; 18 5.08,1.27; 19 7.62,-1.27; 20 7.62,1.27; 21 10.16,-1.27; 22 10.16,1.27; 23 12.7,-1.27; 24 12.7,1.27; 25 15.24,-1.27; 26 15.24,1.27
2X07 = drill 1.016 octagon: 1 -7.62,-1.27; 2 -7.62,1.27; 3 -5.08,-1.27; 4 -5.08,1.27; 5 -2.54,-1.27; 6 -2.54,1.27; 7 0,-1.27; 8 0,1.27; 9 2.54,-1.27; 10 2.54,1.27; 11 5.08,-1.27; 12 5.08,1.27; 13 7.62,-1.27; 14 7.62,1.27
2X08 = drill 1.016 octagon: 1 -8.89,-1.27; 2 -8.89,1.27; 3 -6.35,-1.27; 4 -6.35,1.27; 5 -3.81,-1.27; 6 -3.81,1.27; 7 -1.27,-1.27; 8 -1.27,1.27; 9 1.27,-1.27; 10 1.27,1.27; 11 3.81,-1.27; 12 3.81,1.27; 13 6.35,-1.27; 14 6.35,1.27; 15 8.89,-1.27; 16 8.89,1.27
L2012C = smd 1 x 1: 1 -1,0; 2 1,0
CDRH125 = smd 5.4 x 4: 1 0,4.9; 2 0,-4.9
L2825P = smd 1.4 x 2.4: 1 -1.2,0; 2 1.2,0
CRYSTAL-TXC-7A = smd 1.7 x 2.4: P$1 1.85,0; P$2 -1.85,0
R0603 = smd 1 x 1.1: 1 -0.85,0; 2 0.85,0
SJ_2S-TRACE = smd 0.635 x 1.27: 1 -0.508,0; 2 0.508,0
SJ_2S-NO = smd 0.635 x 1.27: 1 -0.45,0; 2 0.45,0
D-PAK_TO252AA = smd 1 x 1.6: 1 -2.28,-4.8; 3 2.28,-4.8 | smd 5.4 x 6.2: 4 0,2.5

### Placement (x,y rotation side)
ALIVE  75.31,18.75 90 top
C1  9.5,7.62 180 top
C2  60,55.62 90 top
C3  30.48,48.26 270 top
C4  30.48,44.45 270 top
C5  30.48,40.64 270 top
C6  30.48,36.83 270 top
C7  30.48,33.02 270 top
C8  11.98,68.64 270 top
C9  30.48,29.21 270 top
C10  17.35,62.02 180 top
C11  39.03,46.99 0 top
C12  50.34,50.81 0 top
C13  5.08,13.45 180 top
C14  5.08,18.52 180 top
C15  30.48,25.4 270 top
C16  30.48,21.59 270 top
C17  21.59,50.8 180 top
C19  44.98,59.62 270 top
C20  45.16,66.47 270 top
C21  64.09,40.31 0 top
C22  41.22,28.57 180 top
C23  42.53,45.72 270 top
C24  56.52,45.5 180 top
C25  51.19,48.07 270 top
C26  63.13,28.96 270 top
C27  64.09,37.78 0 top
C28  18.39,4.05 90 top
C29  41.27,31.11 0 top
C30  54.61,31.75 180 top
C31  45,56.25 90 top
C32  50.47,63.5 180 top
C33  56.54,60.96 180 top
C34  58.42,12.7 0 top
C35  54.61,12.7 0 top
C36  50.8,12.7 0 top
C37  46.99,12.7 180 top
C38  50.43,20.28 180 top
C39  46.99,17.78 180 top
C40  50.47,66.04 180 top
C41  56.54,66.04 180 top
C42  60.96,66.04 180 top
C43  35.56,11.43 90 top
C44  29.21,16.5 270 top
C45  30.79,6.49 90 top
C46  14.05,7.66 180 top
C47  26.71,16.5 270 top
C48  2.81,50.62 90 top
D1  6.25,59.69 180 top
D2  21.59,58.42 270 top
D3  25.4,8.26 90 top
FID1  72.19,12.81 0 top
FID2  4.06,66.88 0 top
IC1  22.86,69.85 0 top
IC2  40.62,12.81 270 top
IC3  SN65HVD230DR  [SO08']  7.62,50.8 270 top
IC4  48.26,38.1 180 top
IC5  21.4,4.35 180 top
IC6  6.88,38.75 270 top
IC7  68.27,65.71 180 top
IC8  41.91,20.32 180 top
IC9  55.94,25.31 180 top
J1  70,31.56 90 top
JP1  68.58,50.8 270 top
JP2  15.24,35.56 90 top
JP3  54.61,6.35 180 top
JP7  50.8,74.93 0 top
L1  56.88,52.5 0 top
L2  35.08,63.92 180 top
L3  55.96,49.06 90 top
L4  25.21,4.35 90 top
LOGO1  34.38,75.31 0 top
PWR  71.25,18.75 90 top
Q1  63.06,33.58 90 top
R1  8.89,10.16 0 top
R2  21.59,25.4 0 top
R3  21.59,27.94 0 top
R4  21.59,30.48 0 top
R5  21.59,33.02 0 top
R6  21.59,35.56 0 top
R7  21.59,38.1 0 top
R8  21.59,40.64 0 top
R9  21.59,43.18 0 top
R10  27.94,48.26 90 top
R11  5.14,10.2 180 top
R12  27.94,44.45 90 top
R13  27.94,40.64 90 top
R14  8.89,21.07 0 top
R15  8.89,45.72 180 top
R16  21.59,45.72 0 top
R17  21.59,17.78 180 top
R18  21.59,22.86 180 top
R19  27.94,36.83 90 top
R20  21.59,15.24 180 top
R21  21.59,20.32 180 top
R22  8.89,15.98 0 top
R23  27.94,33.02 90 top
R24  8.89,13.45 180 top
R25  8.89,18.52 180 top
R26  27.94,29.21 90 top
R27  27.94,25.4 90 top
R29  27.94,21.59 90 top
R31  21.59,48.26 0 top
R32  71.25,22.81 270 top
R33  75.31,22.81 270 top
R35  22.04,8.79 0 top
R36  18.41,8.79 0 top
R37  50.5,61.13 0 top
R38  56.55,58.69 0 top
R39  48.12,56.25 90 top
R40  62.17,12.7 180 top
R41  58.44,15.24 180 top
R42  54.61,15.24 180 top
R43  74.93,65.39 90 top
R44  50.8,15.24 180 top
R45  54.61,17.78 0 top
R46  46.99,15.24 180 top
R47  50.47,68.58 0 top
R48  56.54,68.58 0 top
R49  60.96,68.58 0 top
R50  56.52,63.5 0 top
R51  60.96,63.5 0 top
R52  26.74,13.04 270 top
SJ1  3.44,45.31 90 top
SJ2  19.06,22.81 0 top
SJ3  18.75,17.81 0 top
SJ4  11.56,11.56 270 top
T1  6.56,27.81 0 top
U$1  59.06,15 0 top

### Tracks (layer width: path | path; a pad name or v marks a point on that pad's centre or on a via)
+12V  (via drill 0.6)
  Top 0.305: v3.81,46.99 3.49,46.98 3.44,46.09 SJ1.2
  Top 0.813: v3.81,46.99 12.7,46.99 JP2.24 | v2.19,56.25 4.05,58.11 D1.A
  Bottom 0.813: v3.81,46.99 2.19,48.61 v2.19,56.25
CANH
  Top 0.406: IC3.7 13.34,51.44 JP2.26
CANL
  Top 0.406: JP2.25 15.24,49.53 12.7,49.53 12.06,50.16 IC3.6
ENC_A/S2
  Top 0.305: JP2.3 16.56,22.81 SJ2.1 18.61,21.07 19.38,20.31 R21.2
ENC_B/S3
  Top 0.305: JP2.1 16.51,19.6 SJ3.1 18.3,16.39 19.38,15.31 20.67,15.31 R20.2
ENC_Z/R1
  Top 0.406: JP2.4 15.24,21.59 15.24,13.14 13.1,11 C46.2
GND  (via drill 0.6)
  Top 0.305: J1.5 70.89,35.62 71.25,35.62 72.81,37.19
  Bottom 0.813: v37.47,55.24 v37.47,52.7
  pour Top: 1.27,78.74 78.74,78.74 78.74,1.27 1.27,1.27
I_L1
  Top 0.305: R48.1 54.9,68.58 53.08,70.4 50.27,70.4 48.26,72.41 48.26,75.08 47.13,76.2 JP7.6
I_L2
  Top 0.305: R49.1 58.29,70.4 54.17,70.4 52.07,72.5 JP7.9
MTEMP+
  Top 0.406: R15.1 JP2.22
MTEMP-
  Top 0.406: R31.1 R16.1 JP2.21
N$1
  Top 0.305: SJ1.1 4.18,44.06 6.25,44.06 6.56,43.75 6.56,35.94 8.2,34.3 IC6.9
N$2
  Top 0.305: IC4.6 57.21,36.85 58.63,35.43 Q1.P$1 63.24,35.61 C27.1
N$3
  Top 0.305: SJ3.2 19.23,17.78 R17.2
N$4
  Top 0.305: IC4.5 56.36,36.35 61.01,31.7 61.04,31.73 Q1.P$2 63.13,31.66 C26.1
N$5  (via drill 0.6)
  Top 0.305: J1.2 69.06,32.53 v69.06,28.75 | v38.12,23.12 38.12,34.06 39.41,35.35 IC4.46
  Bottom 0.305: v69.06,28.75 69.06,22.5 68.12,21.56 58.12,21.56 57.19,22.5 38.75,22.5 v38.12,23.12
N$6  (via drill 0.6)
  Top 0.305: J1.4 68.39,33.12 66.25,33.12 65.31,32.19 v65.31,28.75 | v46.25,25.62 44.06,27.81 44.06,31.25 44.51,31.7 IC4.49
  Bottom 0.305: v65.31,28.75 63.12,26.56 53.44,26.56 52.81,25.94 46.56,25.94 v46.25,25.62
N$7
  Top 0.305: L3.1 55.67,47.77 C24.2 55.62,45.45 55.62,44.38 56.25,43.75 56.25,41.56 55.04,40.35 IC4.13
N$8
  Top 0.305: SJ2.2 19.56,22.86 R18.2
N$9
  Top 0.305: SJ4.2 10.67,10.16 R1.2
  Top 0.406: R1.2 10.45,9.45 C1.1
N$10
  Top 0.305: IC7.11 68.14,62.98 68.17,62.95 68.17,61.88 67.25,60.96 64.77,60.96 | 64.77,60.96 C33.1 R38.2 | 64.77,60.96 65.73,61.92 IC7.9
N$11
  Top 0.406: C44.2 C47.2 26.71,13.92 R52.1
N$12
  Top 0.406: R40.2 61.32,14.3 60.31,15.31 59.36,15.31 R41.1
N$14
  Top 0.813: 21.09,63.99 IC1.2 21.16,61.05 D2.C 33.48,60.62 L2.1
N$15  (via drill 0.6)
  Top 0.305: R37.2 51.32,61.16 C32.1 51.46,63.36 v52.7,63.36 | IC7.4 68.21,68.36 68.44,68.59 68.44,70.62 68.11,70.95 v67.65,70.95 65.95,70.95 65.62,70.62 65.62,68.41 IC7.6
  Bottom 0.305: v52.7,63.36 53.69,63.36 59.3,68.97 65.67,68.97 v67.65,70.95
N$17
  Top 0.406: R44.1 R42.2 C35.1
N$18
  Top 0.305: C37.1 C36.1
  Top 0.406: R44.2 C36.1
N$19
  Top 0.406: IC2.7 45.39,13.45 C37.2 R46.2
N$20
  Top 0.406: C46.1 15,9.29 16.51,10.79 23.81,10.79 25.21,12.2 R52.2 26.75,12.19 28.44,12.19 30.97,14.72 IC2.1
N$21
  Top 0.406: R35.2 23.36,9.26 D3.C 30.68,9.26 C45.+ 34.22,12.28 C43.2 36.73,13.45 IC2.2
N$22
  Top 0.406: R32.2 PWR.A
N$23
  Top 0.406: R33.2 ALIVE.A
N$24
  Top 0.406: R35.1 R36.2 19.27,6.84 IC5.3
N$25
  Top 0.813: IC1.1 19.14,64.38 | IC1.1 18.8,64.71 C8.+ 11.98,63.22 D1.C | C10.1 18.2,62.8 IC1.1
N$26
  Top 0.406: IC5.1 24.91,5.65 L4.2 25.21,7.07 D3.A
N$27
  Top 0.406: C39.2 44.69,16.33 44.69,15.31 44.09,14.72 IC2.8
N$28
  Top 0.305: L1.2 57.88,52.55 | JP1.1 62.13,55.88 | 60.01,54.69 C2.1
  Top 0.406: 57.88,52.55 C2.1 | 62.13,55.88 60.94,54.69 60.01,54.69
N$30
  Top 0.406: R42.1 R41.2 57.59,12.72 C34.1
NRST
  Top 0.305: IC4.7 58.59,37.35 59.38,36.56 61.25,36.56 61.88,37.19 61.88,39.34 62.66,40.12 C21.1
OUT_BRAKE
  Top 0.406: JP2.10 13.27,30.48 12.5,31.25 12.5,35.62 11.25,36.88 9.98,36.88 IC6.11
OUT_DCSW  (via drill 0.6)
  Top 0.406: IC6.10 11.3,35.58 11.56,35.31 11.56,33.33 11.25,33.02 10.52,33.02 v10.31,32.81
  Top 0.61: v10.31,32.81 9.06,32.81 T1.4
  Bottom 0.61: JP2.12 10.52,33.02 v10.31,32.81
OUT_ERR
  Top 0.406: JP2.14 13.81,35.56 11.25,38.12 IC6.12
OUT_OVTMP
  Top 0.406: JP2.16 12.53,38.1 11.25,39.38 IC6.13
  Top 0.61: JP2.16 13.96,38.12
OUT_PRE
  Top 0.305: 12.06,43.17 12.04,43.2
  Top 0.61: 12.06,43.17 12.7,43.18 JP2.20 | 12.04,43.2 IC6.16 IC6.15
OUT_TEMP
  Top 0.406: JP2.18 9.96,40.64 IC6.14
PA1/TIM2_CH2  (via drill 0.6)
  Top 0.305: IC7.13 IC7.14 73.52,64.55 | 73.52,64.55 R43.1 75.12,64.35 v77.12,64.35 | IC7.2 IC7.1 73.52,66.87 73.52,64.55 | IC7.13 71.02,62.9 | IC4.15 54.79,41.35 55.68,42.24 55.68,42.88 53.76,44.8 53.76,53.16 61.08,60.48 69.74,60.48 70.81,61.55 IC7.13 | IC9.1 56.92,26.24 59.73,23.43 61.24,23.43 62.81,25 71.88,25 77.19,30.31 77.19,51.77 v77.12,51.84
  Bottom 0.305: v77.12,51.84 v77.12,64.35
PA2/ADC2  (via drill 0.6)
  Top 0.305: C9.1 30.5,30.08 v32.01,30.08 | v58.88,38.72 v58.88,43.21 | v54.08,43.21 53.96,42.76 IC4.16 | R26.2 27.88,30 25.31,30 24.83,30.48 R4.2
  Top 0.406: R26.2 C9.1
  Bottom 0.305: v32.01,30.08 39.29,30.08 42.09,27.29 42.1,27.3 52.13,27.3 52.88,28.05 58.24,28.05 58.88,28.69 v58.88,38.72 | v58.88,43.21 v54.08,43.21
PA3/ADC3  (via drill 0.6)
  Top 0.305: v52.19,35.05 52.01,35.23 52.16,35.38 52.16,43.52 IC4.17 | v32.17,33.99 32.05,33.87 C7.1 | v51.44,29.21 51.73,29.21 | 51.77,29.21 v51.44,29.21 | IC9.3 52.31,29.21 v51.44,29.21
  Top 0.406: R5.2 25.4,33.02 26.25,33.87 R23.2 C7.1
  Bottom 0.305: v32.17,33.99 45.54,33.99 45.87,34.32 45.87,35.31 47.52,36.96 50.16,36.96 52.07,35.05 v52.19,35.05 52.19,29.96 v51.44,29.21
PA4/ADC4  (via drill 0.6)
  Top 0.305: C6.1 30.61,37.81 v31.86,37.81 | v50.31,38.1 50.18,38.01 50.18,40.61 50.51,40.94 IC4.20
  Top 0.406: R6.2 24.13,35.56 26.25,37.68 R19.2 C6.1
  Bottom 0.305: v31.86,37.81 32.17,38.12 50,38.12 v50.31,38.1
PA5/ADC5  (via drill 0.6)
  Top 0.305: R48.2 C41.1 57.39,63.52 R50.2 58.11,63.5 v59.52,62.09 62.73,62.09 63.5,62.87 64.22,62.87 IC7.8 64.46,64.42 66.92,66.88 66.92,68.22 IC7.5 | 49.95,56.97 v49.92,57.27 50.23,57.27 50.34,57.19 50.34,49.69 50,49.38 50,46.48 50.4,46.08 50.4,45.1 50.01,44.71 IC4.21
  Bottom 0.305: v49.92,57.27 51.31,55.88 56.52,55.88 59.52,58.88 v59.52,62.09
PA6/TIM3_CH1  (via drill 0.6)
  Top 0.305: IC4.22 49.51,45.2 v49.5,45.54 C12.1 | 22.44,20.45 R21.1 | v32.69,47.17 33.34,46.52 33.34,37.78 36.2,34.92 36.2,26.02 v34.95,24.79 | 25.79,19.19 25.92,19.06 v35,19.06
  Top 0.406: R21.1 24.69,20.31 25.79,19.19
  Bottom 0.305: v49.5,45.54 48.18,46.86 34.38,46.88 34.08,47.17 v32.69,47.17 | 34.9,24.73 v34.95,24.79 34.95,19.11 v35,19.06
PA7/TIM3_CH2  (via drill 0.6)
  Top 0.305: R20.1 23.41,15.24 v23.8,14.85 | v48.18,42.24 49.01,43.07 IC4.23
  Top 0.406: C11.1 38.75,46.42 v38.75,45.62
  Bottom 0.305: v23.8,14.85 11.45,14.85 6.6,10 3.3,10 2.31,10.99 2.31,42.53 4.17,44.4 29.11,44.4 30.91,46.2 38.75,46.2 42.57,46.2 44.88,43.89 46.53,43.89 v48.18,42.24
  Bottom 0.406: v38.75,45.62 38.75,46.2
PA8/TIM1_CH1  (via drill 0.6)
  Top 0.305: IC4.41 46.63,37.85 47.19,37.29 47.19,34.98 v47.52,34.65 | v58.43,22.75 58.43,20.29 66.04,12.99 66.04,6.35 64.77,5.08 JP3.2 | v50.04,23.43 50.04,24.89 46.99,27.94 46.99,28.95 v46.87,29.07 v46.86,29.07
  Bottom 0.305: v47.52,34.65 47.52,29.73 v46.86,29.07 | v50.04,23.43 57.75,23.43 v58.43,22.75
PA9/TIM1_CH2  (via drill 0.6)
  Top 0.305: IC4.42 43.83,37.35 v44.88,36.3 | v36.6,35.97 36.68,35.9 36.68,26.73 v36.63,24.77
  Bottom 0.305: v44.88,36.3 36.94,36.3 v36.6,35.97 | v36.63,24.77 36.63,22.44 37.92,21.14 37.92,3.94 39.27,2.59 54.66,2.59 JP3.6
PA10/TIM1_CH3  (via drill 0.6)
  Top 0.305: IC4.43 43.67,36.85 43.89,36.63 43.89,33.33 43.23,32.67 43.23,27.39 45.54,25.08 45.54,23.43 46.2,22.77 v46.2,21.43
  Bottom 0.305: v46.2,21.43 46.2,13.18 43.18,10.16 43.18,4.72 44.32,3.58 50.57,3.58 JP3.10
PA11/CANRX  (via drill 0.6)
  Top 0.305: IC4.44 40.52,36.35 36.25,40.62 36.25,50 33.44,52.81 20,52.81 17.81,55 v13.44,55 | v6.88,48.26 6.74,48.26 6.25,48.75 5.15,48.75 IC3.4
  Bottom 0.305: v6.88,48.26 v13.44,55
PA12/CANTX
  Top 0.305: IC3.1 6.36,54.06 17.81,54.06 19.69,52.19 33.12,52.19 35.62,49.69 35.62,40.31 40.09,35.85 IC4.45
PB0/ADC8  (via drill 0.6)
  Top 0.305: v64.3,66.24 64.3,68.15 IC7.7 62.08,68.31 R49.2 C42.1 R51.2 | v66.86,65.28 67,65.14 IC7.10 | IC4.26 47.51,49.65 v46.99,50.16
  Bottom 0.305: v64.3,66.24 65.26,65.28 v66.86,65.28 67.28,65.28 69.2,63.36 69.2,55.34 65.93,52.07 49.53,52.07 47.62,50.16 v46.99,50.16
PB1/ADC9  (via drill 0.6)
  Top 0.305: v46.88,42.24 47.01,42.32 IC4.27 | v5.62,43.12 5.55,43.2 IC6.1 IC6.2
  Bottom 0.305: v5.62,43.12 6.88,41.88 30.92,41.88 31.54,42.5 45.62,42.5 45.88,42.24 v46.88,42.24
PB5  (via drill 0.6)
  Top 0.305: IC4.57 48.51,31.02 47.55,30.07 46.54,30.07 v45.54,29.07 | v33.71,31.68 33.71,27.59 32.39,26.27 32.39,23.43 31.4,22.44 C16.1
  Top 0.406: R2.2 24.13,25.4 27.09,22.44 R29.2 C16.1
  Bottom 0.305: v45.54,29.07 42.25,29.07 39.97,31.35 34.06,31.35 v33.71,31.68
PB6/TIM4_CH1  (via drill 0.6)
  Top 0.305: C15.1 30.59,26.25 v32.39,28.05 | IC4.58 49.01,29.74 52.8,25.95 v52.8,25.13
  Top 0.406: R3.2 24.13,27.94 25.82,26.25 R27.2 C15.1
  Bottom 0.305: v32.39,28.05 39.32,28.05 42.61,24.77 46.74,24.77 47.1,25.13 v52.8,25.13
PB7/TIM4_CH2  (via drill 0.6)
  Top 0.305: IC4.59 49.51,31.03 49.5,31.02 49.83,30.69 52.4,30.69 52.73,30.36 58.08,30.36 58.74,29.7 58.74,27.7 60.39,26.05 71.05,26.05 75.62,30.62 75.62,35.62 73.44,37.81 73.44,50.94 65.94,58.44 v61.56,58.44 | v52.7,59.4 52.04,60.06 50.39,60.06 49.65,60.8 R37.1
  Bottom 0.305: v52.7,59.4 52.7,60.06 56.33,63.69 60.62,63.69 61.61,62.7 61.61,58.48 v61.56,58.44
PB8/TIM4_CH3  (via drill 0.6)
  Top 0.305: IC4.61 50.49,32.42 50.49,36.3 49.5,37.29 v49.5,42.24 | v43.56,49.17 44.55,48.18 v44.55,45.54 | R38.1 55.67,58.66 v55.67,56.86
  Bottom 0.305: v49.5,42.24 46.2,45.54 v44.55,45.54 | v43.56,49.17 42.24,50.49 42.24,55.11 45.21,58.08 54.35,58.08 55.57,56.86 v55.67,56.86
PB9/TIM4_CH4  (via drill 0.6)
  Top 0.305: v51.25,39.05 51.56,39.06 51.56,37.19 51.01,36.63 IC4.62 | v5.62,40.62 3.83,40.62 IC6.3
  Bottom 0.305: v5.62,40.62 6.89,39.36 36.48,39.36 36.8,39.04 51.23,39.04 v51.25,39.05
PB10/USART3_TX  (via drill 0.6)
  Top 0.305: v46.99,51.44 46.01,50.45 IC4.29
  Bottom 0.305: JP1.3 48.26,53.34 46.99,52.07 v46.99,51.44
PB11/USART3_RX  (via drill 0.6)
  Top 0.305: v45.31,52.22 45.51,52.02 IC4.30
  Bottom 0.305: JP1.4 63.5,54.61 46.99,54.61 45.31,52.93 v45.31,52.22
PB12/TIM1_BKIN  (via drill 0.6)
  Top 0.305: IC4.33 40.96,41.85 v39.06,43.75 | v32.48,43.75 32.79,43.75 32.78,43.76 32.78,37.51 35.69,34.6 35.69,27.08 34.1,25.48 34.1,24.01 38.12,19.98 47.39,19.98 48.31,19.06 53.12,19.06 55.29,21.23 IC9.4
  Bottom 0.305: v39.06,43.75 v32.48,43.75
PC0/ADC10  (via drill 0.6)
  Top 0.305: v60.33,37.81 54,37.81 IC4.8 | v6.35,20.43 5.93,20.01 C14.1
  Top 0.406: C14.1 R25.2
  Bottom 0.305: v60.33,37.81 60.33,28.57 59.08,27.32 53.1,27.32 52.45,26.67 41.75,26.67 41.73,26.65 39.18,29.2 11.63,29.2 6.3,23.87 6.35,23.82 v6.35,20.43
PC1/ADC11  (via drill 0.6)
  Top 0.305: IC4.9 56.91,38.35 v57.28,38.72 | R24.2 6.26,13.45 6.08,13.62 6.08,14.9 v5.76,15.22 | v57.28,29.05 57.28,26.73 58.78,25.23 v59.26,25.23
  Top 0.406: R24.2 C13.1
  Bottom 0.305: v57.28,38.72 57.92,38.08 57.92,29.69 v57.28,29.05 | 59.12,25.23 v59.26,25.23 58.98,25.23 57.81,24.06 51.88,24.06 51.56,24.38 47.81,24.38 47.5,24.06 39.93,24.06 37.29,26.7 11.45,26.7 7.5,22.75 7.5,16.25 6.47,15.22 v5.76,15.22
PC2/ADC12  (via drill 0.6)
  Top 0.305: C17.1 R31.2 22.57,48.12 v24.06,48.12 | IC4.10 55.7,38.85 57.51,40.66 57.51,43.31 59.7,45.5 59.7,46.11 v59.77,46.18
  Bottom 0.305: v24.06,48.12 24.69,47.5 31.54,47.5 32.17,48.12 34.38,48.12 35,47.5 51.25,47.5 51.23,47.51 52.48,47.51 52.48,47.5 53.79,46.18 v59.77,46.18
PC3/ADC13
  Top 0.305: R47.2 C40.1 52.7,66.04 53.98,64.77 53.98,55.24 52.8,54.06 52.8,39.68 53.13,39.35 IC4.11
PC4/ADC14
  Top 0.305: R39.1 48.51,55.02 IC4.24
  Top 0.406: R39.1 C31.1
PC5/ADC15
  Top 0.305: IC4.25 48.01,52.09 46.34,53.77 20.62,53.77 18.11,56.28 4.41,56.28 1.89,53.76 1.89,37.49 2.5,36.88 3.77,36.88 IC6.6
PC6  (via drill 0.6)
  Top 0.305: C5.1 30.55,41.56 v31.86,41.56 | v39.06,41.56 40.77,39.85 IC4.37
  Top 0.406: R7.2 24.13,38.1 27.52,41.49 R13.2 C5.1
  Bottom 0.305: v31.86,41.56 v39.06,41.56
PC7  (via drill 0.6)
  Top 0.305: IC4.38 42.54,39.37 39.37,39.37 37.79,40.95 v37.79,44.76 | v32.41,45.08 32.33,45.3 C4.1
  Top 0.406: R8.2 22.86,40.64 27.52,45.3 R12.2 C4.1
  Bottom 0.305: v37.79,44.76 32.72,44.76 32.48,45 v32.41,45.08
PC8  (via drill 0.6)
  Top 0.305: IC4.39 38.95,38.85 36.83,40.97 36.83,48.08 v37.81,49.06 | C3.1 30.53,49.06 v32.17,49.06
  Top 0.406: R9.2 23.5,43.18 26.04,45.72 26.04,47.62 27.52,49.11 R10.2 C3.1
  Bottom 0.305: v32.17,49.06 v37.81,49.06
PC9  (via drill 0.6)
  Top 0.305: IC4.40 47.78,38.35 48.18,37.95 48.18,35.97 v48.51,35.64 | v48.18,29.07 48.18,28.38 52.51,24.05 v52.51,20.46 | 52.47,17.78 v52.51,17.81 52.57,17.75 R45.1 53.76,17.82 56.25,20.31 56.25,22.5 56.59,22.84 IC9.6
  Top 0.406: C38.1 51.46,20.46 v52.51,20.46
  Bottom 0.305: v48.51,35.64 48.51,29.39 v48.18,29.07 | JP3.13 45.72,8.89 45.72,10.16 52.51,16.95 v52.51,17.81 v52.51,20.46
PC10  (via drill 0.6)
  Top 0.305: IC4.51 45.51,34.47 45,34.98 v44.88,34.98 | v5.62,38.22 3.91,38.22 IC6.5
  Bottom 0.305: v44.88,34.98 44.88,34.86 44.7,34.69 35.62,34.69 35.31,35 30.37,35 29.67,34.3 9.55,34.3 v5.62,38.22
PC11  (via drill 0.6)
  Top 0.305: v46.27,36.88 46.01,36.8 IC4.52 | v5.62,39.44 3.85,39.44 IC6.4
  Bottom 0.305: v46.27,36.88 45.64,37.5 35,37.5 34.38,36.88 8.19,36.88 v5.62,39.44
PC12  (via drill 0.6)
  Top 0.305: v47.54,21.43 46.86,22.11 46.86,24.09 47.19,24.42 47.19,26.07 44.55,28.71 44.55,30.8 45,31.25 46.25,31.25 46.51,31.51 IC4.53 | v75.24,15.18 75.24,17.63 ALIVE.C
  Bottom 0.305: v75.24,15.18 66.66,15.18 61.05,20.79 57.75,20.79 57.09,21.45 57.07,21.43 v47.54,21.43
PC13  (via drill 0.6)
  Top 0.305: v56.43,34.71 56.44,34.85 IC4.2 | v4.38,24.69 4.28,24.59 T1.1
  Bottom 0.305: v56.43,34.71 56.43,32.53 51.84,27.94 42.44,27.94 42.42,27.92 39.65,30.69 33.38,30.69 32.39,31.68 32.39,31.7 11.24,31.7 4.38,24.84 v4.38,24.69
PD2/TIM3_ETR  (via drill 0.6)
  Top 0.305: v34.7,33 35.03,32.98 35.03,27.41 33.38,25.76 33.38,23.78 37.92,19.23 37.92,17.18 40.59,14.52 40.59,10.56 41.25,9.9 v47.85,9.9 | v45.54,30.39 46.01,30.39 46.25,30.62 46.56,30.62 47.01,31.07 IC4.54
  Top 0.406: v64.53,12.2 63.56,12.2 R40.1
  Bottom 0.305: v34.7,33 35.69,32.01 40.3,32.01 41.95,30.36 45.52,30.36 v45.54,30.39 | v64.53,12.2 50.15,12.2 v47.85,9.9
S4/S1
  Top 0.305: R11.1 5.99,10.68 7.19,11.88 11.37,11.88 SJ4.1 11.56,17.91 JP2.2
SIG_BMS
  Top 0.406: R9.1 JP2.19
SIG_BRAKE
  Top 0.406: R4.1 JP2.9
SIG_CRUISE
  Top 0.406: R2.1 JP2.5
SIG_EMCYSTOP
  Top 0.406: R8.1 JP2.17
SIG_FORWARD
  Top 0.406: R6.1 JP2.13
SIG_MPROT
  Top 0.406: R5.1 JP2.11
SIG_REVERSE
  Top 0.406: R7.1 JP2.15
SIG_START
  Top 0.406: R3.1 JP2.7
THROTTLE1
  Top 0.305: JP2.6 12.19,23.62 12.19,19.38 10.94,18.12 10.94,16.56 10.36,15.98 R22.2
  Top 0.406: R22.2 R24.1
THROTTLE2
  Top 0.305: JP2.8 11.25,25.22 11.25,21.88 10.44,21.07 R14.2
  Top 0.406: R14.2 R25.1
TIM1_CH1N  (via drill 0.6)
  Top 0.305: IC4.34 42.61,41.4 44.1,41.4 v44.4,41.7 | 59.69,7.51 JP3.3 60.96,6.35 60.96,3.81 61.59,3.17 65.41,3.17 67.31,5.08 v67.31,7.62
  Bottom 0.305: v44.4,41.7 44.7,41.4 76.8,41.4 78.3,39.9 78.3,9.72 77.47,8.89 68.58,8.89 v67.31,7.62
TIM1_CH2N  (via drill 0.6)
  Top 0.305: IC4.35 42.51,40.8 v41.1,40.8
  Bottom 0.305: v41.1,40.8 76.2,40.8 77.7,39.3 77.7,11.38 76.5,10.18 67.33,10.18 66.04,8.89 66.04,7.62 64.77,6.35 55.73,6.35 54.61,7.47 JP3.7
TIM1_CH3N  (via drill 0.6)
  Top 0.305: IC4.36 42.59,40.32 44.16,40.32 v44.48,40
  Bottom 0.305: v44.48,40 75.84,40 76.8,39.04 76.8,11.8 75.84,10.84 65.45,10.84 64.24,9.63 64.24,9.57 50.21,9.57 49.53,8.89 JP3.11
TMPHS  (via drill 0.6)
  Top 0.305: v48.12,59.69 R39.2
  Bottom 0.305: JP7.13 53.8,70.31 50.62,70.31 48.12,67.81 v48.12,59.69
UDC
  Top 0.305: 44.45,76.11 JP7.4 44.4,76.2 43.22,75.02 43.22,72.65 44.2,71.67 46.53,71.67 R47.1
VCC  (via drill 0.6)
  Top 0.305: R18.1 22.49,22.81 v23.75,22.81 | R17.1 22.58,17.92 v23.68,17.92 | R43.2 v76.78,66.24 | IC7.3 69.42,68.19 v69.42,66.24 | IC1.4 24.38,63.87 v24.38,62.3 | R45.2 55.52,17.81 v56.88,17.81
  Top 0.406: R11.2 v4.16,8.32 | R15.2 v6.35,45.72 | IC8.3 39.6,21.49 v39.79,21.41 | 25.36,3.2 L4.1 25.21,3.05 IC5.5 IC5.4 18.54,3.05 C28.1 18.3,3.12 v16.51,3.12
  Top 0.813: C19.1 45.09,60.58 v45.09,62 | C20.+ 45.09,64.04 v45.09,62 | L2.2 41.9,62 v45.09,62
  Bottom 0.305: v23.75,22.81 24.69,22.81 | v23.68,17.92 24.32,17.92 | v76.78,66.24 76.78,67.2 | v69.42,66.24 69.74,65.92 69.74,65.6 | v24.38,62.3 24.69,62.19 | v56.88,17.81 57.5,17.81
  Bottom 0.406: v4.16,8.32 5.11,8.29 | v6.35,45.72 6.99,45.72 | v39.79,21.41 40.45,21.41 | v16.51,3.12 16.2,3.12
  pour Bottom: 1.27,78.74 78.74,78.74 78.75,59.06 39.38,59.06 39.38,22.52 78.75,22.5 78.75,1.27 1.27,1.27
VCCIO  (via drill 0.6)
  Top 0.305: IC4.64 53.11,32.4 C30.2 53.96,31.95 53.76,32.15 v53.76,33.28 53.96,33.48 IC4.1 | IC8.2 41.9,23.82 | IC4.19 51.01,45.25 v51.53,45.77 51.19,46.12 C25.2 | v41.58,49.17 40.92,48.51 40.92,45.21 41.26,44.87 C23.2 43.6,43.8 | v58.12,50 58.06,50.06 L3.2 55.88,50.06 | IC9.5 55.94,24.69 55.62,25 v54.38,25 | J1.1 70.94,32.53 v70.94,28.75 | v8.24,48.26 8.24,48.32 6.56,50 5.17,50 IC3.3 3.2,50.16 C48.1
  Top 0.406: IC4.32 43.6,43.8 | R32.1 73.35,23.66 v73.44,23.75 75.22,23.75 R33.1 75.34,23.69 | 41.9,23.82 42.16,24.08 C22.1 42.12,29.25 C29.2 41.91,31.33 v41.91,33.02 42.56,33.67 IC4.48 | 55.88,50.06 L1.1
  Top 0.813: v74.93,38.1 74.93,41.91 v76.2,43.18
  Bottom 0.305: 54.4,33.28 v53.76,33.28 | 50.88,45.44 v51.53,45.77 | 42.24,49.17 v41.58,49.17 39.95,50.8 24.13,50.8 20.32,46.99 9.52,46.99 v8.24,48.26 | v58.12,50 56.25,50 | v54.38,25 54.38,25.31 | v70.94,28.75 70.62,28.75
  Bottom 0.406: 73.44,24.38 v73.44,23.75 | 41.27,33.02 v41.91,33.02
  pour Bottom: 78.75,58.12 40.31,58.12 40.31,23.44 78.75,23.44

### Text on the board
tNames: (C) 2020 Johannes Huebner | openinverter.org main board rev 1.4
bStop: (c) 2020 Johannes Huebner | openinverter.org